# EAGLE design SparkFun RTK Facet - Display SD (EAGLE 9.6.2)
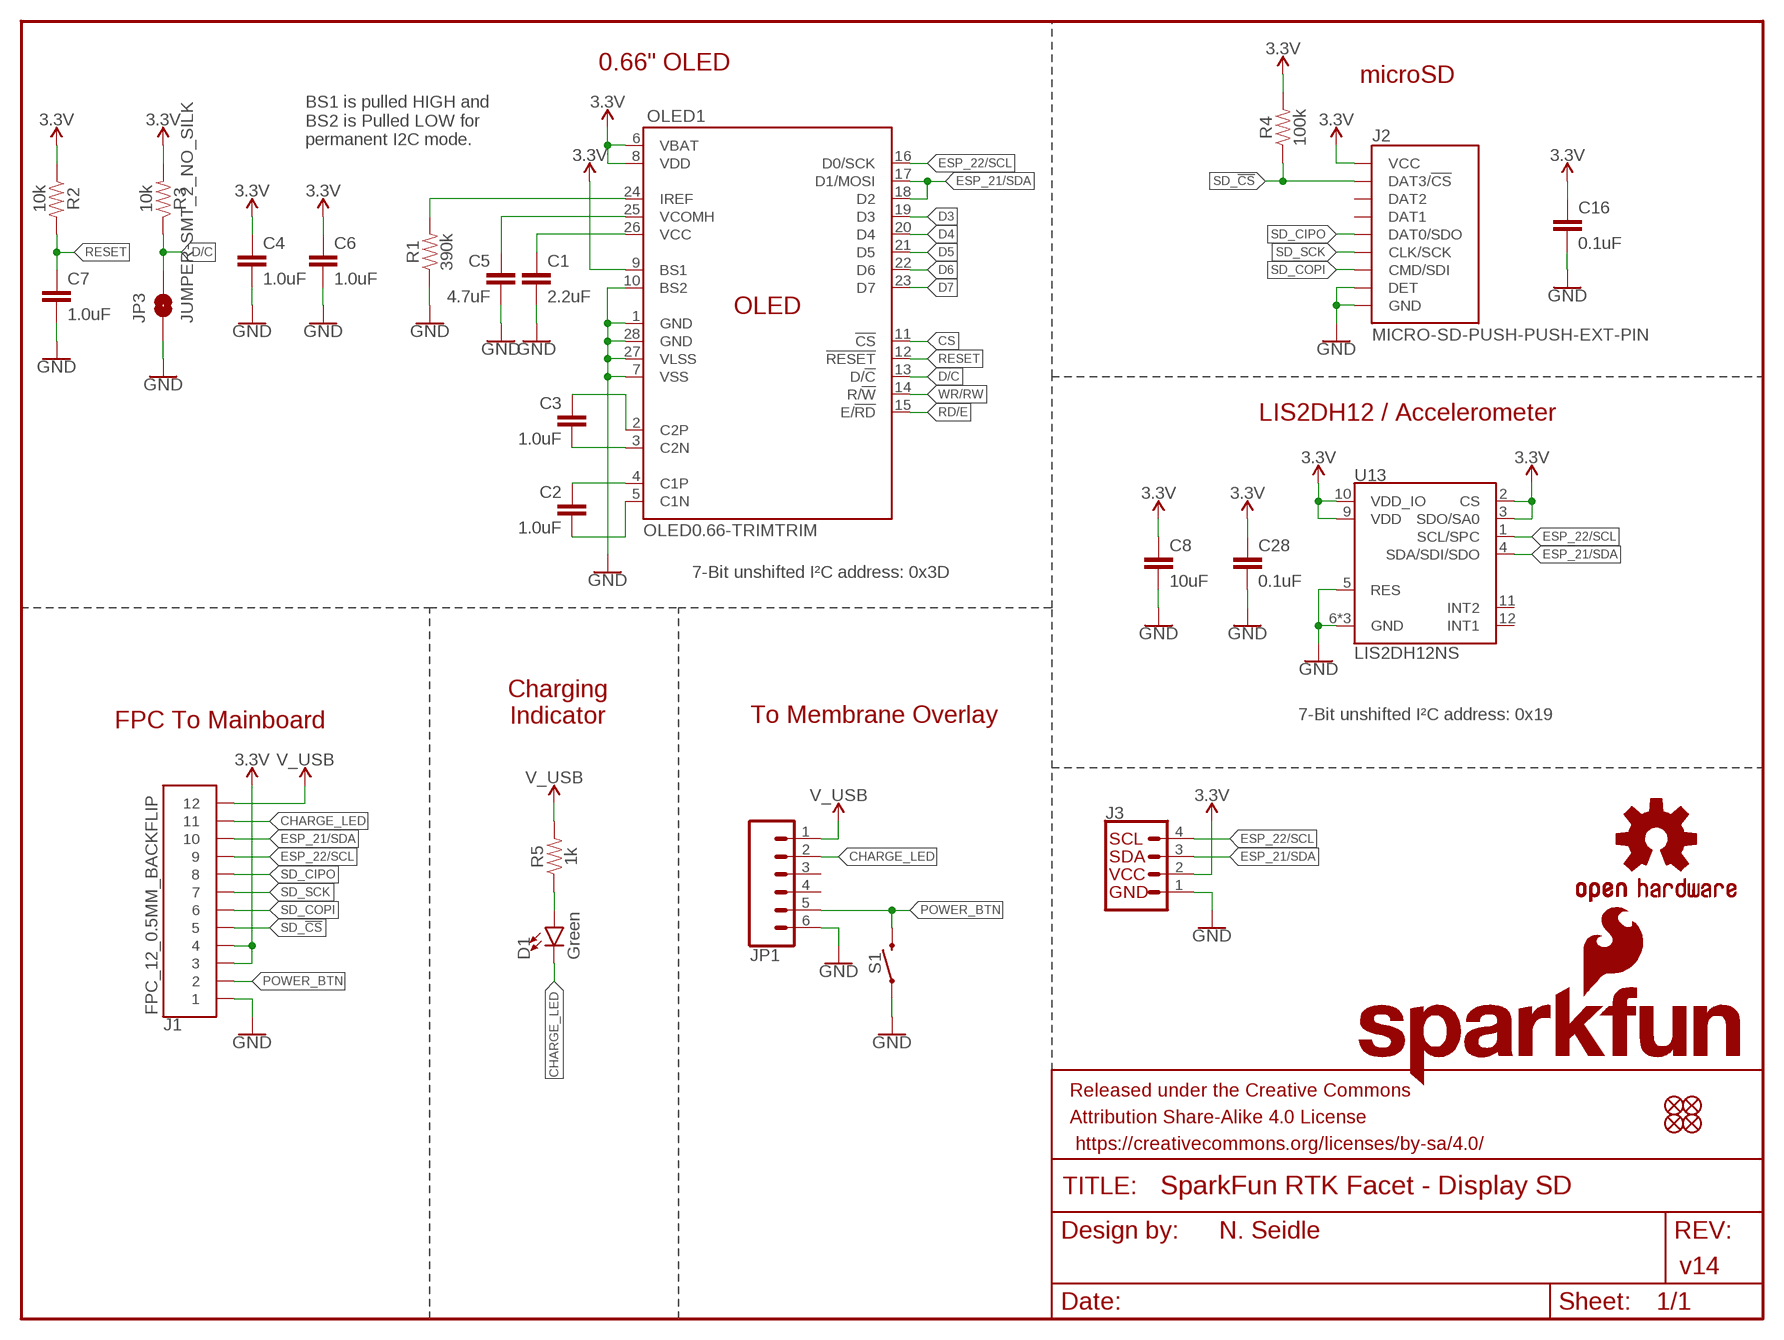
[diagram p0: schematic, sheet 1]

## Parts
C1  2.2uF  2.2UF-0805-25V-(+80/-20%)  [0805]
C2  1.0uF  1.0UF-0805-25V-10%  [0805]
C3  1.0uF  1.0UF-0805-25V-10%  [0805]
C4  1.0uF  1.0UF-0603-16V-10%  [0603]
C5  4.7uF  4.7UF-1206-16V-(+80/-20%)  [1206]
C6  1.0uF  1.0UF-0603-16V-10%  [0603]
C7  1.0uF  1.0UF-0603-16V-10%  [0603]
C8  10uF  10UF-0603-6.3V-20%  [0603]
C16  0.1uF  0.1UF-0603-25V-(+80/-20%)  [0603]
C28  0.1uF  0.1UF-0603-25V-(+80/-20%)  [0603]
D1  Green  LED-GREEN1206-BOTTOM  [LED-1206-BOTTOM]
FID1  FIDUCIAL1X2  [FIDUCIAL-1X2]
FID2  FIDUCIAL1X2  [FIDUCIAL-1X2]
FID3  FIDUCIAL1X2  [FIDUCIAL-1X2]
FID4  FIDUCIAL1X2  [FIDUCIAL-1X2]
FRAME1  FRAME-LETTER  [CREATIVE_COMMONS]
J1  FPC_12_0.5MM_BACKFLIP  [FPC_12_DOUBLESIDED_BACKFLIP]
J2  MICRO-SD-PUSH-PUSH-EXT-PIN  [MICROSD-EXTERNALPIN]
J3  I2C_STANDARD_NO_SILK  [1X04_NO_SILK]
JP1  CONN_061MM-LIF  [FPC_6_1MM-LIF]
JP3  JUMPER-SMT_2_NO_SILK  [SMT-JUMPER_2_NO_SILK]
LOGO3  OSHW-LOGOMINI  [OSHW-LOGO-MINI]
LOGO5  SFE_LOGO_NAME_FLAME8_MM  [SFE_LOGO_NAME_FLAME_8MM]
OLED1  OLED0.66-TRIMTRIM  [OLED-0.66-64X48-TRIM]
R1  390k  390KOHM-0603-1/10W-1%  [0603]
R2  10k  10KOHM-0603-1/10W-1%  [0603]
R3  10k  10KOHM-0603-1/10W-1%  [0603]
R4  100k  100KOHM-0603-1/10W-1%  [0603]
R5  1k  1KOHM-0603-1/10W-1%  [0603]
S1  MOMENTARY-SWITCH-SPST-SMD-5.2MM-TALL  [TACTILE_SWITCH_SMD_5.2MM]
U13  LIS2DH12NS  [LGA-12-LISDH12-NOSILK]

## Nets
3.3V [power]: C4.1 C6.1 C8.1 C16.1 C28.1 J1.3 J1.4 J2.4(VCC) J3.2 OLED1.6(VBAT) OLED1.8(VDD) OLED1.9(BS1) R2.1 R3.2 R4.2 U13.2(CS) U13.3(SDO/SA0) U13.9(VDD) U13.10(VDD_IO)
C1P: C2.1 OLED1.4(C1P)
C2N: C3.2 OLED1.3(C2N)
CHARGE_LED: D1.C J1.11 JP1.2
CS: OLED1.11(!CS!)
D3: OLED1.19(D3)
D4: OLED1.20(D4)
D5: OLED1.21(D5)
D6: OLED1.22(D6)
D7: OLED1.23(D7)
D/C: JP3.2 OLED1.13(D/!C!) R3.1
ESP_21/SDA: J1.10 J3.3 OLED1.17(D1/MOSI) OLED1.18(D2) U13.4(SDA/SDI/SDO)
ESP_22/SCL: J1.9 J3.4 OLED1.16(D0/SCK) U13.1(SCL/SPC)
GND: C1.2 C4.2 C5.2 C6.2 C7.2 C8.2 C16.2 C28.2 J1.1 J2.6(GND) J2.9(DET) J2.10(GND) J2.11(GND) J2.12(GND) J2.13(GND) J3.1 JP1.6 JP3.1 OLED1.1(GND) OLED1.7(VSS) OLED1.10(BS2) OLED1.27(VLSS) OLED1.28(GND) R1.1 S1.1 U13.5(RES) U13.6(GND) U13.7(GND) U13.8(GND)
IREF: OLED1.24(IREF) R1.2
N$1: C3.1 OLED1.2(C2P)
N$2: C2.2 OLED1.5(C1N)
N$3: D1.A R5.1
POWER_BTN: J1.2 JP1.5 S1.3
RD/E: OLED1.15(E/!RD!)
RESET: C7.1 OLED1.12(!RESET!) R2.2
SD_!CS!: J1.5 J2.2(DAT3/!CS!) R4.1
SD_CIPO: J1.8 J2.7(DAT0/SDO)
SD_COPI: J1.6 J2.3(CMD/SDI)
SD_SCK: J1.7 J2.5(CLK/SCK)
V_USB: J1.12 JP1.1 R5.2
VCC: C1.1 OLED1.26(VCC)
VCOMH: C5.1 OLED1.25(VCOMH)
WR/RW: OLED1.14(R/!W!)
Unconnected: J2.1(DAT2) J2.8(DAT1) JP1.3 JP1.4 U13.11(INT2) U13.12(INT1)

## Notes on the sheet
- 0.66" OLED
- microSD
- BS1 is pulled HIGH and 
  BS2 is Pulled LOW for 
  permanent I2C mode.
- LIS2DH12 / Accelerometer
- 7-Bit unshifted I²C address: 0x3D
- Charging
  Indicator
- FPC To Mainboard | To Membrane Overlay | 7-Bit unshifted I²C address: 0x19
- N. Seidle
- v14

## Library data of the parts
C1 = SparkFun-Capacitors:2.2UF: 2.2µF ceramic capacitors A capacitor is a passive two-terminal electrical component used to store electrical energy temporarily in an electric field.; PROD_ID: CAP-11624
C2 C3 = SparkFun-Capacitors:1.0UF: 1µF ceramic capacitors A capacitor is a passive two-terminal electrical component used to store electrical energy temporarily in an electric field.; PROD_ID: CAP-08064
C4 C6 C7 = SparkFun-Capacitors:1.0UF: 1µF ceramic capacitors A capacitor is a passive two-terminal electrical component used to store electrical energy temporarily in an electric field.; PROD_ID: CAP-00868
C5 = SparkFun-Capacitors:4.7UF: 4.7µF ceramic capacitors A capacitor is a passive two-terminal electrical component used to store electrical energy temporarily in an electric field.; PROD_ID: CAP-10300
C8 = SparkFun-Capacitors:10UF: 10.0µF ceramic capacitors A capacitor is a passive two-terminal electrical component used to store electrical energy temporarily in an electric field.; PROD_ID: CAP-11015
C16 C28 = SparkFun-Capacitors:0.1UF: 0.1µF ceramic capacitors A capacitor is a passive two-terminal electrical component used to store electrical energy temporarily in an electric field.; PROD_ID: CAP-00810
D1 = SparkFun-LED:LED-GREEN: Green SMD LED Used in manufacturing of various products at SparkFun Packages: 0603 - SMD 0603 package [Product Link] <http://www.futureelectronics.com/en/technologies/semiconductors/optoelectronics/leds/Pages/9894312-LTST-C190GKT.aspx?CrossPart=HSMG-C190&IM=0> LilyPad 1206 - SMD1206 LilyPad package [Product Link] <http://www.futureelectronics.com/en/Technologies/Product.aspx?ProductID=IN150NGHARVATEKCORPORATION2049943&IM=0> 1206 - SMD1206 package [Product Link] <http://www.futureelectronics.com/en/technologies/semiconductors/optoelectronics/leds/Pages/8315665-LTST-C150KGKT.aspx?IM=0> 1206 Bottom Mount -SMD 1206 Bottom Mount [Product Link] <http://www.digikey.com/product-detail/en/lite-on-inc/LTST-C230KGKT/160-1456-1-ND/386854> SparkFun Products: Pro Mini 328 -5V <https://www.sparkfun.com/products/821> RedBoard <https://www.sparkfun.com/products/12757> MP3 Trigger <https://www.sparkfun.com/products/13720> Makey Makey <https://www.sparkfun.com/products/11076>; PROD_ID: DIO-11076
FID1-FID4 = SparkFun-Aesthetics:FIDUCIAL: Fiducial Alignment Points Point-of-reference for pick-and-place machines and other optical instruments.
FRAME1 = SparkFun-Aesthetics:FRAME-LETTER: Schematic Frame - Letter Standard 8.5x11 US Letter frame
J1 = RTK Facet:FPC_12_0.5MM; PROD_ID: CONN-15766
J2 = SparkFun-Connectors:MICRO-SD: microSD Socket for Transflash Various sockets for µSD. tDoc lines correctly indicate media card edge positions when inserting (unlocked, locked, depressed). NOTE: CD1 and CD2 are connected internally, and the default detect state of the socket is detect pin to ground. SparkFun Products: WAV Trigger <https://www.sparkfun.com/products/13660> CAN-Bus Shield <https://www.sparkfun.com/products/13262> SparkFun Level Shifing microSD Breakout <https://www.sparkfun.com/products/13743>; PROD_ID: CONN-16110
J3 = SparkFun-Connectors:I2C_STANDARD: SparkFun I2C Standard Pinout Header SparkFun has standardized on a pinout for all I2C based sensor breakouts. This pinout allows I2C boards to be plugged directly into the headers on Arduino Uno compatible boards, and to be daisy chained easily. Example SparkFun Products: SparkFun Atmospheric Sensor Breakout - BME280 <https://www.sparkfun.com/products/13676> SparkFun Altitude/Pressure Sensor Breakout - MPL3115A2 <https://www.sparkfun.com/products/11084> SparkFun TOF Range Finder Sensor - VL6180 <https://www.sparkfun.com/products/12785>
JP1 = SparkFun-Connectors:CONN_06: Multi connection point. Often used as Generic Header-pin footprint for 0.1 inch spaced/style header connections On any of the 0.1 inch spaced packages, you can populate with these: Break Away Headers - Straight <https://www.sparkfun.com/products/116> (PRT-00116) Break Away Male Headers - Right Angle <https://www.sparkfun.com/products/553> (PRT-00553) Female Headers <https://www.sparkfun.com/products/115> (PRT-00115) Break Away Headers - Machine Pin <https://www.sparkfun.com/products/117> (PRT-00117) Break Away Female Headers - Swiss Machine Pin <https://www.sparkfun.com/products/743> (PRT-00743) Arduino Stackable Header - 6 Pin <https://www.sparkfun.com/products/9280> (PRT-09280) Screw Terminals 2.54mm Pitch (6-Pin) <https://www.sparkfun.com/products/16499> (PRT-16499) For SCREWTERMINALS and SPRING TERMINALS visit here: Screw Terimnals on SparkFun.com <https://www.sparkfun.com/search/results?term=Screw+Terminals> (5mm/3.5mm/2.54mm spacing) This device is also useful as a general connection point to wire up your design to another part of your project. Our various solder wires solder well into these plated through hole pads. Hook-Up Wire - Assortment (Stranded, 22 AWG) <https://www.sparkfun.com/products/11375> (PRT-11375) Hook-Up Wire - Assortment (Solid Core, 22 AWG) <https://www.sparkfun.com/products/11367> (PRT-11367) View the entire wire category on our website here <https://www.sparkfun.com/categories/141>; PROD_ID: CONN-16692
JP3 = SparkFun-Jumpers:JUMPER-SMT_2_NO: Normally open jumper This jumper has two pads in close proximity to each other. Apply solder to close the connection. Round pads are easier to solder for beginners, but are a lot larger. SparkFun Product that uses the round pads: SparkFun EL Sequencer <https://www.sparkfun.com/products/12781>
LOGO3 = SparkFun-Aesthetics:OSHW-LOGO: Open-Source Hardware (OSHW) Logo This logo indicates the piece of hardware it is found on incorporates a OSHW license and/or adheres to the definition of open source hardware found here: http://freedomdefined.org/OSHW
LOGO5 = SparkFun-Aesthetics:SFE_LOGO_NAME_FLAME: SparkFun Font Logo w/ Flame This is the SparkFun full logo. The logo on the schematic will always be the same size; the package variant is the height of the flame part of the logo. Default layer for the logo on the board is tSilk.
OLED1 = SparkFun-Displays:OLED0.66-TRIM: Micro OLED TODO: Add description SparkFun Products: Micro OLED Breakout <https://www.sparkfun.com/products/13003>
R1 = SparkFun-Resistors:390KOHM: 390kΩ resistor A resistor is a passive two-terminal electrical component that implements electrical resistance as a circuit element. Resistors act to reduce current flow, and, at the same time, act to lower voltage levels within circuits. - Wikipedia; PROD_ID: RES-12024
R2 R3 = SparkFun-Resistors:10KOHM: 10kΩ resistor A resistor is a passive two-terminal electrical component that implements electrical resistance as a circuit element. Resistors act to reduce current flow, and, at the same time, act to lower voltage levels within circuits. - Wikipedia; PROD_ID: RES-00824
R4 = SparkFun-Resistors:100KOHM: 100kΩ resistor A resistor is a passive two-terminal electrical component that implements electrical resistance as a circuit element. Resistors act to reduce current flow, and, at the same time, act to lower voltage levels within circuits. - Wikipedia; PROD_ID: RES-07828
R5 = SparkFun-Resistors:1KOHM: 1kΩ resistor A resistor is a passive two-terminal electrical component that implements electrical resistance as a circuit element. Resistors act to reduce current flow, and, at the same time, act to lower voltage levels within circuits. - Wikipedia; PROD_ID: RES-07856
S1 = SparkFun-Switches:MOMENTARY-SWITCH-SPST: Momentary Switch (Pushbutton) - SPST Normally-open (NO) SPST momentary switches (buttons, pushbuttons). Variants PTH-12MM - 12mm square, through-hole Momentary Pushbutton Switch - 12mm Square <https://www.sparkfun.com/products/9190> (COM-09190) PTH-6.0MM, PTH-6.0MM-KIT - 6.0mm square, through-hole Mini Pushbutton Switch <https://www.sparkfun.com/products/97> (COM-00097) KIT package intended for soldering kit's - only one side of pads' copper is exposed. PTH-RIGHT-ANGLE-KIT - Right-angle, through-hole Right Angle Tactile Button <https://www.sparkfun.com/products/10791> - Used on SparkFun BigTime Watch Kit <https://www.sparkfun.com/products/11734> SMD-12MM - 12mm square, surface-mount Tactile Button - SMD (12mm) <https://www.sparkfun.com/products/12993> (COM-12993) Used on SparkFun PicoBoard <https://www.sparkfun.com/products/11888> SMD-4.5MM - 4.5mm Square Trackball Switch Used on SparkFun Blackberry Trackballer Breakout <https://www.sparkfun.com/products/13169> SMD-4.6MMX2.8MM - 4.60mm x 2.80mm, surface mount Used on SparkFun Pro Micro - RP2040 <https://www.sparkfun.com/products/17717> SMD-5.2MM, SMD-5.2-REDUNDANT - 5.2mm square, surface-mount Mini Pushbutton Switch - SMD <https://www.sparkfun.com/products/8720> (COM-08720) Used on Arduino Pro Mini <https://www.sparkfun.com/products/11114> REDUNDANT package connects both switch circuits together SMD-6.0X3.5MM - 6.0 x 3.5mm, surface mount Momentary Reset Switch SMD <https://www.sparkfun.com/products/8229> (COM-08229) SMD-6.2MM-TALL - 6.2mm square, surface mount Tactile Button - SMD (6mm) <https://www.sparkfun.com/products/12992> Used on SparkFun Digital Sandbox <https://www.sparkfun.com/products/12651> SMD-RIGHT-ANGLE - Right-angle, surface mount Used on SparkFun Block for Intel® Edison - Arduino <https://www.sparkfun.com/products/13036>; PROD_ID: SWCH-14139
U13 = SparkFun-Sensors:LIS2DH12; PROD_ID: IC-14229

## Net classes
0 default: width 0.127 mm
1 power: width 0.178 mm

## Board
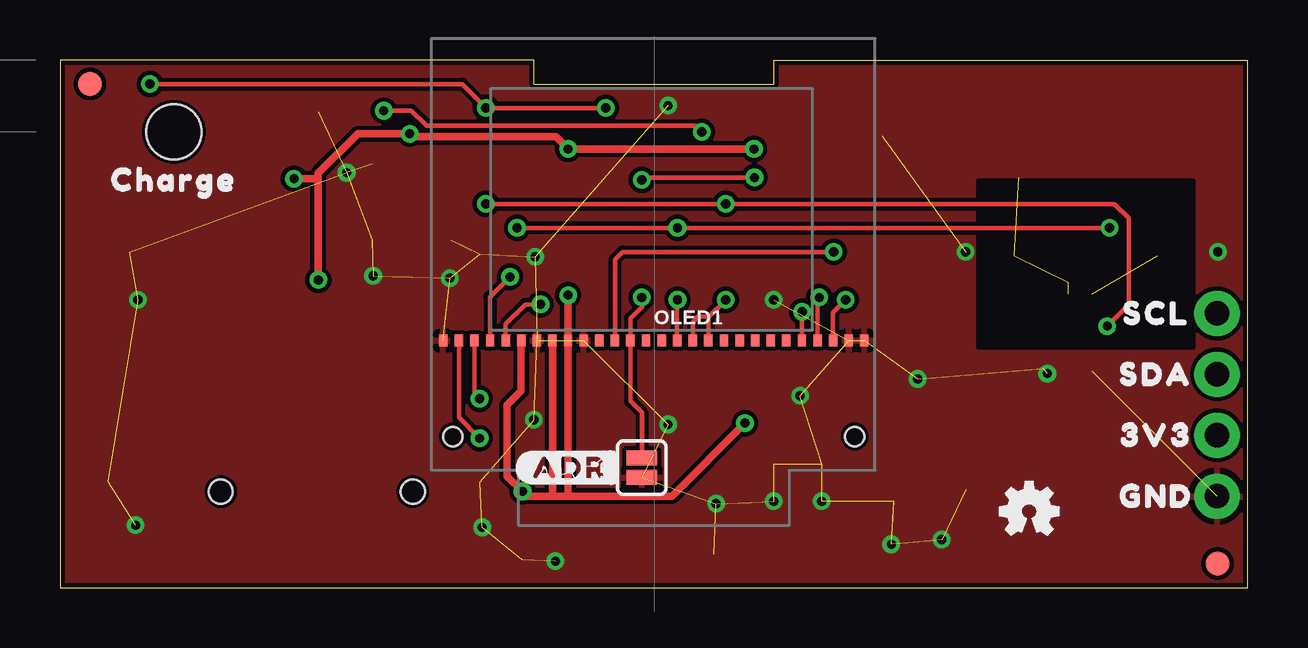
[diagram p1: board, top side]
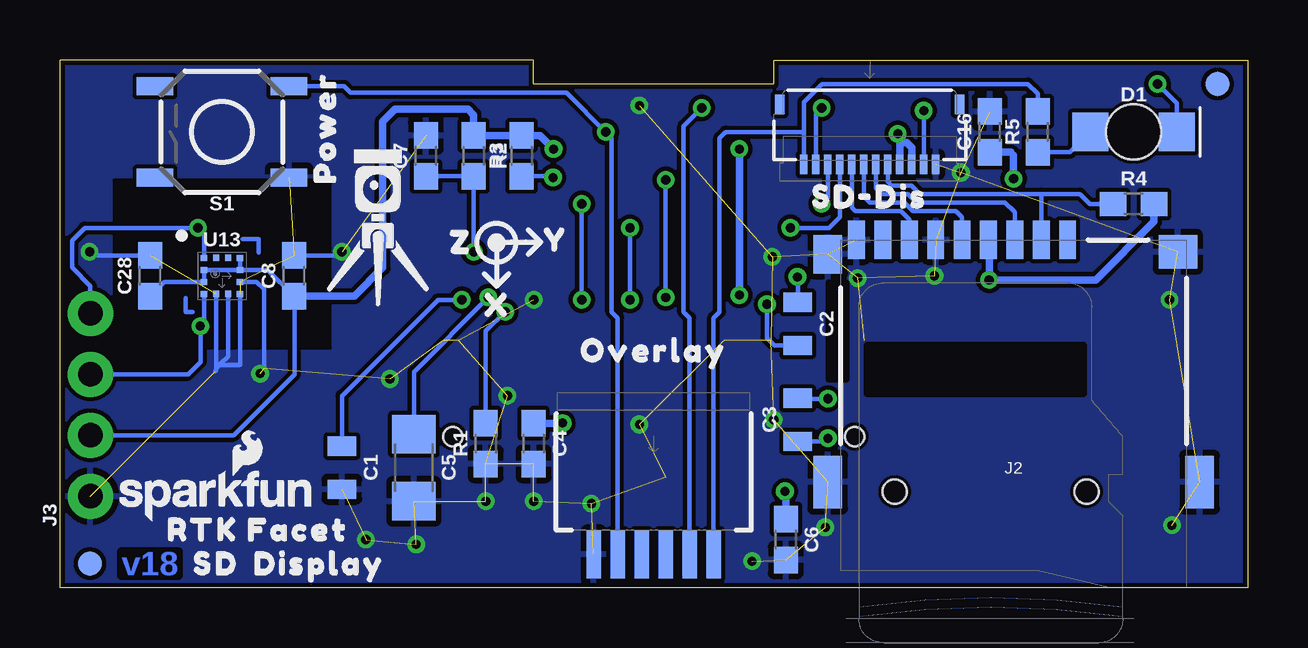
[diagram p2: board, bottom side, seen from below]

Size 49.5 x 22 mm. Coordinates in mm from the lower left corner, seen from the top.
Outline: 49.5,0 49.5,22 29.75,22 29.75,21 19.75,21 19.75,22 0,22 0,0 49.5,0
Copper layers (1*16): Top/Vert 0.035mm / dielectric 1.5mm / Bottom/Horz 0.035mm
Design rules "SparkFun-2-layer-TIGHT": minimum track width 7mil, minimum drill 15mil, track to track 7mil, track to pad 7mil, pad to pad 7mil, via to via 7mil, smd to smd 7mil, copper to edge 7mil, drill to drill 7mil, minimum pad ring 7mil, minimum via ring 7mil, stop-mask expansion 4mil, vias tented up to drill 25mil, thermal gap 10mil
tKeepout: area 0,0 to 2,22; area 47.5,0 to 49.5,22
bKeepout: area 0,0 to 2,22; area 47.5,0 to 49.5,22

### Footprints (pad centres in the part's own frame; a part is rotated, then mirrored left to right if it is on the bottom)
0805 = smd 0.8 x 1.2: 1 -0.9,0; 2 0.9,0
0603 = smd 1.1 x 1: 1 -0.85,0; 2 0.85,0
1206 = smd 1.6 x 1.8: 1 -1.4,0; 2 1.4,0
LED-1206-BOTTOM = smd 1.5 x 1.6: A -1.8,0; C 1.8,0 | hole 2.3: 0,0
FIDUCIAL-1X2 = smd 1 x 1: 1 0,0
FPC_12_DOUBLESIDED_BACKFLIP = smd 0.3 x 0.8: 1 -2.75,1.35; 2 -2.25,1.35; 3 -1.75,1.35; 4 -1.25,1.35; 5 -0.75,1.35; 6 -0.25,1.35; 7 0.25,1.35; 8 0.75,1.35; 9 1.25,1.35; 10 1.75,1.35; 11 2.25,1.35; 12 2.75,1.35 | smd 0.4 x 0.8: MP1 -3.75,-1.15; MP2 3.75,-1.15
MICROSD-EXTERNALPIN = smd 0.7 x 1.6: 1 2.25,10.5; 2 1.15,10.5; 3 0.05,10.5; 4 -1.05,10.5; 5 -2.15,10.5; 6 -3.25,10.5; 7 -4.35,10.5; 8 -5.45,10.5; 9 -6.55,10.5 | smd 1.2 x 1.6: 10 -7.75,9.9 | smd 1.2 x 2.2: 11 -7.75,0.4; 12 7.75,0.4 | smd 1.6 x 1.4: 13 6.85,10 | hole 1: 3.05,0; -4.95,0
1X04_NO_SILK = drill 1.016 pad 1.88: 1 0,0; 2 2.54,0; 3 5.08,0; 4 7.62,0
FPC_6_1MM-LIF = smd 0.6 x 2: 1 -2.5,3; 2 -1.5,3; 3 -0.5,3; 4 0.5,3; 5 1.5,3; 6 2.5,3
SMT-JUMPER_2_NO_SILK = smd 0.635 x 1.27: 1 -0.406,0; 2 0.406,0
OLED-0.66-64X48-TRIM = smd 0.35 x 0.5: 1 -8.775,0.6; 2 -8.125,0.6; 3 -7.475,0.6; 4 -6.825,0.6; 5 -6.175,0.6; 6 -5.525,0.6; 7 -4.875,0.6; 8 -4.225,0.6; 9 -3.575,0.6; 10 -2.925,0.6; 11 -2.275,0.6; 12 -1.625,0.6; 13 -0.975,0.6; 14 -0.325,0.6; 15 0.325,0.6; 16 0.975,0.6; 17 1.625,0.6; 18 2.275,0.6; 19 2.925,0.6; 20 3.575,0.6; 21 4.225,0.6; 22 4.875,0.6; 23 5.525,0.6; 24 6.175,0.6; 25 6.825,0.6; 26 7.475,0.6; 27 8.125,0.6; 28 8.775,0.6 | hole 0.8: 8.375,-3.4; -8.375,-3.4
TACTILE_SWITCH_SMD_5.2MM = smd 1.524 x 0.762: 1 -2.794,1.905; 2 2.794,1.905; 3 -2.794,-1.905; 4 2.794,-1.905
LGA-12-LISDH12-NOSILK = smd 0.275 x 0.25: 1 -0.75,0.75; 2 -0.75,0.25; 3 -0.75,-0.25; 4 -0.75,-0.75; 7 0.75,-0.75; 8 0.75,-0.25; 9 0.75,0.25; 10 0.75,0.75 | smd 0.25 x 0.275: 5 -0.25,-0.75; 6 0.25,-0.75; 11 0.25,0.75; 12 -0.25,0.75

### Placement (x,y rotation side)
C1  37.75,5 270 bottom
C2  18.75,11 270 bottom
C3  18.75,7 90 bottom
C4  29.75,6 270 bottom
C5  34.75,5 270 bottom
C6  19.25,2 270 bottom
C7  34.25,18 90 bottom
C8  39.75,13 90 bottom
C16  10.75,19 90 bottom
C28  45.75,13 90 bottom
D1  4.75,19 0 bottom
FID1  48.25,1 0 top
FID2  1.25,21 0 top
FID3  1.25,21 0 bottom
FID4  48.25,1 0 bottom
FRAME1  -24.93,-12.5 0 bottom  (outside the outline)
J1  15.75,19 180 bottom
J2  9.75,4 0 bottom
J3  48.23,3.81 90 bottom
JP1  24.75,4.38 180 bottom
JP3  24.25,5 90 top
LOGO3  40.4,3.19 0 top
LOGO5  43.02,3.94 0 bottom
OLED1  24.75,9.7 0 top
R1  31.75,6 90 bottom
R2  32.25,18 270 bottom
R3  30.25,18 90 bottom
R4  4.75,16 0 bottom
R5  8.75,19 90 bottom
S1  42.75,19 180 bottom
U13  42.75,13 0 bottom
U$1  [SD#DIS0]  15.75,16.3 0 bottom
U$2  [OVERLAY0]  24.75,9.88 0 bottom
U$3  [DISPLAY0]  38.69,1 0 bottom
U$4  [SD1]  42.99,1 0 bottom
U$5  [RTK5#SVG0]  36.25,15 0 bottom
U$6  SPECIAL_INSTRUCTIONS-ORDERING  [ORDERING_INSTRUCTIONS]  -14.23,50.58 0 bottom  (outside the outline)
U$7  [#ADR#0]  21.25,5 0 top
U$8  [CHARGE0]  4.75,17 0 top
U$9  [POWER0]  38.45,19.18 90 bottom
U$10  [X0]  31.42,11.81 180 bottom
U$11  [Y1]  28.82,14.51 0 bottom
U$12  [Z2]  32.92,14.41 180 bottom
U$13  [RTK_FACET0]  41.25,2.41 0 bottom
U$14  [3V33]  45.69,6.35 0 top
U$15  [GND2]  45.69,3.81 0 top
U$16  [SCL0]  45.69,11.43 0 top
U$17  [SDA1]  45.69,8.89 0 top

### Tracks (layer width: path | path; a pad name or v marks a point on that pad's centre or on a via)
3.3V  (via drill 0.38)
  Top/Vert 0.305: v21.18,12.19 v21.17,12.18 OLED1.9 21.17,3.82 21.18,3.81 | v10.77,12.83 10.77,17.02 | 10.77,17.02 10.77,17.27 12.42,18.92 v14.58,18.92 14.71,18.8 20.67,18.8 v21.18,18.29 v28.93,18.29 | v9.75,17.05 10.74,17.05 10.77,17.02 | v28.55,6.86 25.5,3.81 21.18,3.81 | 21.18,3.81 20.55,3.81 | 20.55,3.81 20.52,3.83 OLED1.8 | OLED1.6 19.22,8.2 18.64,7.62 18.64,4.64 v19.28,4.01 19.48,3.81 20.55,3.81
  Bottom/Horz 0.178: C28.1 45.15,12.75 U13.3 U13.2 U13.9 | U13.9 U13.10 | U13.9 40.85,13.25 C8.1 39.72,12.12 39.72,8.89 42.26,6.35 J3.2
  Bottom/Horz 0.305: v21.18,12.19 v21.18,18.29 | J1.4 14.5,18.54 | 14.5,18.54 14.5,18.84 v14.58,18.92 | 14.5,18.54 14.2,18.54 14,18.34 J1.3 | R4.2 3.9,15.25 6.32,12.83 v10.77,12.83 10.77,14.47 J2.4 | v9.75,17.05 9.75,18.03 9.87,18.15 C16.1 | v28.93,18.29 29.49,18.85 R3.2 R2.1 32.25,19.7 32.49,19.94 35.53,19.94 36.04,19.43 36.04,13.34 37.23,12.15 C8.1 | C4.1 v28.56,6.85 v28.55,6.86 | v19.28,4.01 19.25,3.98 C6.1
C1P  (via drill 0.38)
  Top/Vert 0.178: v18.76,12.95 17.92,12.12 OLED1.4
  Bottom/Horz 0.178: C2.1 v18.75,12.94 v18.76,12.95
C2N  (via drill 0.38)
  Top/Vert 0.178: v17.49,7.87 17.27,8.09 OLED1.3
  Bottom/Horz 0.178: C3.2 18.72,7.87 v17.49,7.87
CHARGE_LED  (via drill 0.38)
  Top/Vert 0.178: v3.75,21 16.75,21 v17.75,20 v22.75,20
  Bottom/Horz 0.178: D1.C 2.95,20.2 v3.75,21 | J1.11 18,19.75 v17.75,20 | v22.75,20 23.5,19.25 23.5,11.5 23.25,11.25 JP1.2
D/C  (via drill 0.38)
  Top/Vert 0.178: v28.95,17.1 24.35,17.1 v24.25,17 | v24.25,12.1 24.25,11.7 23.77,11.22 OLED1.13 23.77,7.78 24.25,7.3 JP3.2
  Bottom/Horz 0.178: R3.1 29,17.15 v28.95,17.1 | v24.25,17 v24.25,12.1
ESP_21/SDA  (via drill 0.38)
  Top/Vert 0.178: v17.75,16 v27.75,16 43.95,16 44.55,15.4 44.55,11.8 v43.65,10.9 | OLED1.18 27.02,11.28 | 27.02,11.28 v27.75,12 | OLED1.17 26.38,11.07 26.6,11.3 27,11.3 27.02,11.28
  Bottom/Horz 0.178: J1.10 17.5,16.25 v17.75,16 | v27.75,12 v27.75,16 | U13.4 43.5,11.05 v43.64,10.91 | v43.64,10.91 v43.65,10.9 | J3.3 44.17,8.89 43.64,9.41 v43.64,10.91
ESP_22/SCL  (via drill 0.38)
  Top/Vert 0.178: OLED1.16 25.72,11.98 v25.74,12 | v19.05,15 v25.74,15 v43.75,15
  Bottom/Horz 0.178: J1.9 17,15.45 17.45,15 v19.05,15 | v25.74,12 v25.74,15 | U13.1 43.5,14.75 v43.75,15 48.47,15 48.99,14.48 48.99,13.34 48.23,12.57 J3.4
GND  (via drill 0.38)  (46 unrouted)
  Bottom/Horz 0.178: C28.2 48.12,13.85 v48.27,14 | U13.5 43,9.14 | 43,9.14 43,9.04 43.03,9.02 | U13.6 42.5,9.64 42.82,9.32 | 42.82,9.32 43,9.14 | U13.7 42,9.28 42.01,9.27 42.77,9.27 42.82,9.32 | U13.8 41.3,12.75 41,12.45 41,9.14 | C8.2 37.9,13.85 v37.75,14
  other vias: 3.15,2.6 20.65,1.1 29.75,12 36.75,2 13.05,13 3.25,12 35.75,8.7 16.25,12.9 11.95,17.3 30.85,8 17.6,2.51 34.65,1.8 31.75,3.6 29.75,3.6 27.35,3.5 19.75,7 25.35,6.8 25.35,20.1 41.15,8.92 19.81,13.79
  pour Bottom/Horz (isolate 0.152): 49.5,0 49.5,22 0,22 0,0
  pour Top/Vert (isolate 0.152): 49.5,0 49.5,22 0,22 0,0
  cutout Bottom/Horz (isolate 0.305): 47.25,17 38.25,17 38.25,10 47.25,10
  cutout Top/Vert (isolate 0.305): 38.25,17 47.25,17 47.25,10 38.25,10
IREF  (via drill 0.38)
  Top/Vert 0.178: OLED1.24 30.92,11.48 v30.94,11.5
  Bottom/Horz 0.178: R1.2 31.75,10.69 v30.94,11.5
N$1  (via drill 0.38)
  Top/Vert 0.178: v17.49,6.22 16.62,7.09 OLED1.2
  Bottom/Horz 0.178: C3.1 17.61,6.1 v17.49,6.22
N$2  (via drill 0.38)
  Top/Vert 0.178: OLED1.5 18.57,10.98 19.4,11.81 v20.03,11.81
  Bottom/Horz 0.178: v20.03,11.81 20.03,10.41 19.72,10.1 C2.2
N$3
  Bottom/Horz 0.178: R5.1 7.4,18.15 D1.A
N$4
  Bottom/Horz 0.178: 41.88,14.53 41.22,14.53 41.22,13.97
N$5
  Bottom/Horz 0.178: 43.96,11.48 44.27,11.48 44.27,12.06
POWER_BTN  (via drill 0.38)
  Top/Vert 0.178: v13.5,19.89 14.64,19.89 15.27,19.25 26.5,19.25 v26.75,19
  Bottom/Horz 0.178: J1.2 v13.5,19.89 | JP1.5 26.25,11.25 26.5,11.5 26.5,18.75 v26.75,19 28.38,20.64 37.39,20.64 37.66,20.91 S1.3
RESET  (via drill 0.38)
  Top/Vert 0.178: OLED1.12 23.12,13.68 23.45,14 v32.25,14
  Bottom/Horz 0.178: v32.25,14 R2.2 C7.1
SD_!CS!
  Bottom/Horz 0.178: J1.5 15,16.92 14.85,16.77 14.01,16.77 13.65,16.41 8.6,16.41 | J2.2 8.6,15.24 8.6,16.41 | R4.1 6.57,16 6.98,16.41 8.6,16.41
SD_CIPO
  Bottom/Horz 0.178: J1.8 16.5,15.85 16.35,15.7 14.45,15.7 14.1,15.35 J2.7
SD_COPI
  Bottom/Horz 0.178: J1.6 15.5,16.66 15.25,16.41 14.15,16.41 13.8,16.06 10.11,16.06 9.7,15.65 J2.3
SD_SCK
  Bottom/Horz 0.178: J1.7 16,16.31 15.75,16.06 14.3,16.06 13.95,15.7 12.15,15.7 11.9,15.45 J2.5
V_USB
  Bottom/Horz 0.178: J1.12 18.5,19 | 18.5,19 18.5,20.25 17.75,21 9.15,21 8.75,20.6 R5.2 | 18.5,19 21.75,19 22,18.75 22,11.5 22.25,11.25 JP1.1
VCC  (via drill 0.38)
  Top/Vert 0.178: OLED1.26 32.23,11.47 v32.75,12
  Bottom/Horz 0.178: v32.75,12 33.75,12 37.75,8 C1.1
VCOMH  (via drill 0.38)
  Top/Vert 0.178: OLED1.25 31.57,12.03 v31.65,12.1
  Bottom/Horz 0.178: C5.1 34.75,9 v31.65,12.1

### Text on the board
Bottom/Horz: v18
bDocu: Board thickness is 1.6mm | 2 Layer Board | ENIG Finish | Red Soldermask | FPC stiffener is 3mm